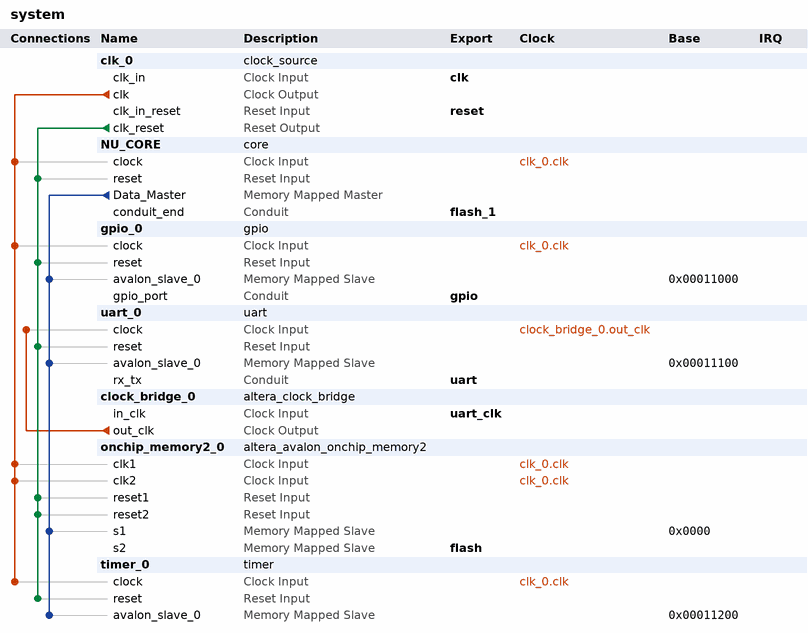
[diagram p0: system contents]
# Platform Designer (Qsys) system system, MAX 10 10M50DAF484C7G
# Parameters at their usual value, and those the tool derives, are not listed.
package require -exact qsys 18.1
create_system system
set_project_property DEVICE_FAMILY {MAX 10}
set_project_property DEVICE 10M50DAF484C7G

add_instance clk_0 clock_source 18.1
set_instance_parameter_value clk_0 clockFrequency 50000000

add_instance NU_CORE core 1.0
set_instance_parameter_value NU_CORE FLASH_SIZE 11

add_instance gpio_0 gpio 1.0

add_instance uart_0 uart 1.0

add_instance clock_bridge_0 altera_clock_bridge 18.1
set_instance_parameter_value clock_bridge_0 DERIVED_CLOCK_RATE 0
set_instance_parameter_value clock_bridge_0 EXPLICIT_CLOCK_RATE 0

add_instance onchip_memory2_0 altera_avalon_onchip_memory2 18.1
set_instance_parameter_value onchip_memory2_0 dataWidth 32
set_instance_parameter_value onchip_memory2_0 dualPort true
set_instance_parameter_value onchip_memory2_0 initMemContent true
set_instance_parameter_value onchip_memory2_0 initializationFileName /home/shaheer/Desktop/Projects/RISC/Demo/DE10/Code/flash/main.hex
set_instance_parameter_value onchip_memory2_0 memorySize 40960
set_instance_parameter_value onchip_memory2_0 readDuringWriteMode OLD_DATA
set_instance_parameter_value onchip_memory2_0 resetrequest_enabled false
set_instance_parameter_value onchip_memory2_0 useNonDefaultInitFile true

add_instance timer_0 timer 1.0

# connections
add_connection clk_0.clk gpio_0.clock clock
add_connection clk_0.clk NU_CORE.clock clock
add_connection clk_0.clk onchip_memory2_0.clk1 clock
add_connection clk_0.clk onchip_memory2_0.clk2 clock
add_connection clk_0.clk timer_0.clock clock
add_connection clock_bridge_0.out_clk uart_0.clock clock
add_connection clk_0.clk_reset gpio_0.reset reset
add_connection clk_0.clk_reset NU_CORE.reset reset
add_connection clk_0.clk_reset onchip_memory2_0.reset1 reset
add_connection clk_0.clk_reset onchip_memory2_0.reset2 reset
add_connection clk_0.clk_reset timer_0.reset reset
add_connection clk_0.clk_reset uart_0.reset reset
add_connection NU_CORE.Data_Master gpio_0.avalon_slave_0 avalon
set_connection_parameter_value NU_CORE.Data_Master/gpio_0.avalon_slave_0 baseAddress 0x00011000
add_connection NU_CORE.Data_Master onchip_memory2_0.s1 avalon
set_connection_parameter_value NU_CORE.Data_Master/onchip_memory2_0.s1 baseAddress 0x0000
add_connection NU_CORE.Data_Master timer_0.avalon_slave_0 avalon
set_connection_parameter_value NU_CORE.Data_Master/timer_0.avalon_slave_0 baseAddress 0x00011200
add_connection NU_CORE.Data_Master uart_0.avalon_slave_0 avalon
set_connection_parameter_value NU_CORE.Data_Master/uart_0.avalon_slave_0 baseAddress 0x00011100

# exported interfaces
add_interface clk clock sink
set_interface_property clk EXPORT_OF clk_0.clk_in
add_interface flash avalon slave
set_interface_property flash EXPORT_OF onchip_memory2_0.s2
add_interface flash_1 conduit end
set_interface_property flash_1 EXPORT_OF NU_CORE.conduit_end
add_interface gpio conduit end
set_interface_property gpio EXPORT_OF gpio_0.gpio_port
add_interface reset reset sink
set_interface_property reset EXPORT_OF clk_0.clk_in_reset
add_interface uart conduit end
set_interface_property uart EXPORT_OF uart_0.rx_tx
add_interface uart_clk clock sink
set_interface_property uart_clk EXPORT_OF clock_bridge_0.in_clk

set_interconnect_requirement {$system} qsys_mm.clockCrossingAdapter HANDSHAKE
set_interconnect_requirement {$system} qsys_mm.enableEccProtection FALSE
set_interconnect_requirement {$system} qsys_mm.insertDefaultSlave FALSE
set_interconnect_requirement {$system} qsys_mm.maxAdditionalLatency 0

save_system system.qsys
